# Altium project ESE516_ExampleBaseProject_V2.PrjPcb (part 2 of 2)

## Sheet Buzzer.SchDoc
size A
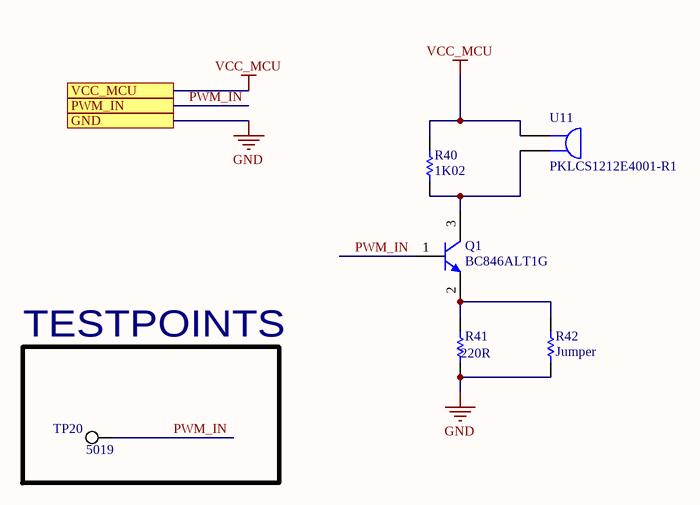
[diagram p9: Buzzer.SchDoc]

### Parts
Q1  BC846ALT1G  [ONSC-SOT-23-3-318-08_V]
R40  1K02  [RESC0603(1608)_N]
R41  220R  [RESC0805(2012)_L]
R42  Jumper  [RESC0603(1608)_N]
TP20  5019  [KSTN-5019_V]
U11  PKLCS1212E4001-R1  [MURA-PKLCS1212E4001-R1-2_V]

### Blocks framed on the sheet
TESTPOINTS: TP20

### Ports
GND, PWM_IN, VCC_MCU

### Nets
GND: R41.1 R42.1 ; port GND
VCC_MCU: R40.2 U11.1 ; port VCC_MCU
PWM_IN: Q1.1(B) TP20.1 ; port PWM_IN  [project net Buzzer]
NetQ1_2: Q1.2(E) R41.2 R42.2
NetQ1_3: Q1.3(C) R40.1 U11.2

### Library data of the parts
Q1 = CMP-1048-00774-1: General Purpose Transistor, NPN Silicon, 3-Pin SOT-23, Pb-Free, Tape and Reel; Manufacturer: On Semiconductor; fT Min (MHz): 100; IC Continuous (A): 0.1; Polarity: NPN; PackageVersion: Rev. AP, 11/2009; RoHS: TRUE; ComponentLink1URL: http://www.onsemi.com/; DatasheetVersion: Rev. 11; ComponentLink3URL: http://www.onsemi.cn/pub_link/Collateral/318-08.PDF; Mounting Technology: Surface Mount; ComponentLink2Description: Datasheet; PartNumber: BC846ALT1G; ComponentLink1Description: Manufacturer URL; ComponentLink3Description: Package Specification; PackageReference: SOT-23-3-318-08; ComponentLink2URL: http://www.onsemi.cn/pub_link/Collateral/BC846ALT1-D.PDF; PackageDescription: 3-Pin Small Outline Transistor, Body 2.92 x 1.3 mm, Pitch 0.95 mm; Packing: Tape and Reel
R40 = CMP-1012-00511-1: 1K02 0.1W 1% 0603 (1608 Metric)  SMD; Value: 1020.00 Ohm; Case-EIA: 0603; Case-Metric: 1608; Technology: SMT; Power: 0.1 W; Tolerance: 1 %
R41 = CMP-1013-00058-1: 220R 0.125W 5% 0805 (2012 Metric)  SMD; Value: 220.00 Ohm; Case-Metric: 2012; Case-EIA: 0805; Technology: SMT; Power: 0.125 W; Tolerance: 5 %
R42 = CMP-1012-00001-1: Jumper 0603 (1608 Metric); Case-Metric: 1608; Value: 0.00 Ohm; Power: None; Case-EIA: 0603; Technology: SMT; Tolerance: None
TP20 = CMP-1672-00008-1: Test Point, 1 Position SMD, RoHS, Tape and Reel; ComponentLink1Description: Manufacturer URL; Package Quantity: 1000; DatasheetVersion: 03/2014; Packaging: Tape and Reel; ComponentLink2URL: http://www.keyelco.com/product-pdf.cfm?p=1357; ComponentLink1URL: http://www.keyelco.com/; Mount: Surface Mount; Contact Plating: Silver; PackageDescription: 1-Pin Surface Mount Device, Body 3.81 x 2.03 mm; Pins: 1; RoHSCompliant: True; Mounting Technology: Surface Mount; ComponentLink2Description: Datasheet; PackageReference: 5019
U11 = CMP-2000-05277-1: Piezoelectric Sound Component, 4 KHz, -20 to 70 degC, 2-Pin SMD, RoHS, Tape and Reel; Manufacturer: Murata; Port Location: Side; Operating Mode: Continuous; Voltage Range: 25V(Max); Driver Circuitry: Transducer,ExternallyDriven; Other Names: 490-4683-6; Input Type: peak-peakSignal; Voltage - Rated: 3Vp-p; Online Catalog: PKSeries; Frequency: 4kHz; Featured Product: SMDPiezoelectricSounders; Washable: No; Current - Supply: -; Datasheet Version: Jul-12; Packaging: Digi-Reel; Category: AudioProducts; Standard Package: 1; Manufacturer URL: http://www.murata.com/; Mounting Type: SurfaceMount; Technology: Piezo; Sound Pressure Level: -; Termination: SolderPads; Family: Buzzers; Capacitance @ Frequency: -; Size / Dimension: 12.0mmLx12.0mmWx3.0mmH; Operating Temperature: -20degC~70degC; Series: PK; Datasheet URL: https://datasheet.ciiva.com/34302/1874527-34302938.pdf

## Nets that join several sheets
GND: TM2_MAIN (7 pins), FTDI (17 pins), Memory (6 pins), 5vBoost (C3.1 C4.2), 3.3VBuck (C1.1 U1.6), MCU (21 pins), Servo Motor (5 pins), LiPo_Charger (8 pins), LiPo_fuel_guage (5 pins), Buzzer (R41.1 R42.1)
V_5V: 5vBoost (C3.2 U2.3 U2.4 U2.7), 3.3VBuck (C1.2 U1.0 U1.1), Servo Motor (DS1.1 P1.4 U10.7)
Vbat: TM2_MAIN (P2.2), LiPo_Charger (C14.2), LiPo_fuel_guage (R13.2 TP3.1 U5.7)
VCC_MCU: TM2_MAIN (6 pins), Memory (9 pins), 3.3VBuck (C2.2 L1.2 R1.2), MCU (7 pins), Buzzer (R40.2 U11.1)
Vin: 5vBoost (L2.2 U2.9 U2.10), LiPo_Charger (5 pins)
VUSB: FTDI (6 pins), LiPo_Charger (C12.2 U4.13)
BQ_BAT_TS: TM2_MAIN (R28.2), LiPo_Charger (TP1.1 U4.1)
BQ_EN_1: TM2_MAIN (R30.2), MCU (U7.14), LiPo_Charger (U4.6)
BQ_EN_2: TM2_MAIN (R31.1), MCU (U7.22), LiPo_Charger (U4.5)
BQ_SYSOFF: TM2_MAIN (R32.1), MCU (U7.27), LiPo_Charger (U4.15)
Buzzer: MCU (U7.34), Buzzer (Q1.1 TP20.1)
Control: MCU (U7.18), Servo Motor (P1.2 TP14.1)
Feedback: MCU (U7.31), Servo Motor (C26.2 TP13.1 U10.2 U10.6)
FLASH_MEM_SPI_SS: Memory (R16.1 R23.2 SD1.2 TP12.1), MCU (U7.37)
Guage_Int: TM2_MAIN (R37.2), MCU (U7.36), LiPo_fuel_guage (TP2.1 U5.12)
INT_2: TM2_MAIN (P4.2 TP19.1), MCU (U7.13)
MCU_LED: TM2_MAIN (DS2.2), MCU (U7.16)
MEM_SPI_CLK: TM2_MAIN (R36.2), Memory (R20.1 SD1.5 TP11.1)
MEM_SPI_MISO: TM2_MAIN (R35.2), Memory (R22.1 SD1.7 TP10.1)
MEM_SPI_MOSI: TM2_MAIN (R34.2), Memory (R21.1 SD1.3 TP9.1)
SCL_2: TM2_MAIN (P4.4 R38.2 TP17.1), MCU (U7.39), LiPo_fuel_guage (U5.2)
SCL_IR: TM2_MAIN (P3.3 TP15.1), MCU (U7.9)
SDA_2: TM2_MAIN (P4.3 R39.2 TP18.1), MCU (U7.38), LiPo_fuel_guage (U5.1)
SDA_IR: TM2_MAIN (P3.2 TP16.1), MCU (U7.15)
SERCOM1_PAD2_SPI_MISO: TM2_MAIN (R35.1), MCU (U7.8)
SERCOM1_PAD2_SPI_MOSI: TM2_MAIN (R34.1), MCU (U7.11)
SERCOM1_PAD3_SPI_SCK: TM2_MAIN (R36.1), MCU (U7.12)
SERCOM4_UART_RX_CLI: FTDI (U3.7), MCU (U7.43)
SERCOM4_UART_TX_CLI: FTDI (U3.10), MCU (U7.44)

## Assembly variants
SD_CARD: not fitted C22 R7 R16 R17 R18 R19 R20 R21 R22 U8